# EAGLE schematic eib-256 (EAGLE 8.3.2)
DESIGNER: JON NEWMAN; DESIGN_NAME: EIB-256; LICENSE: CERN OHL v1.2; REVISION: 1.1
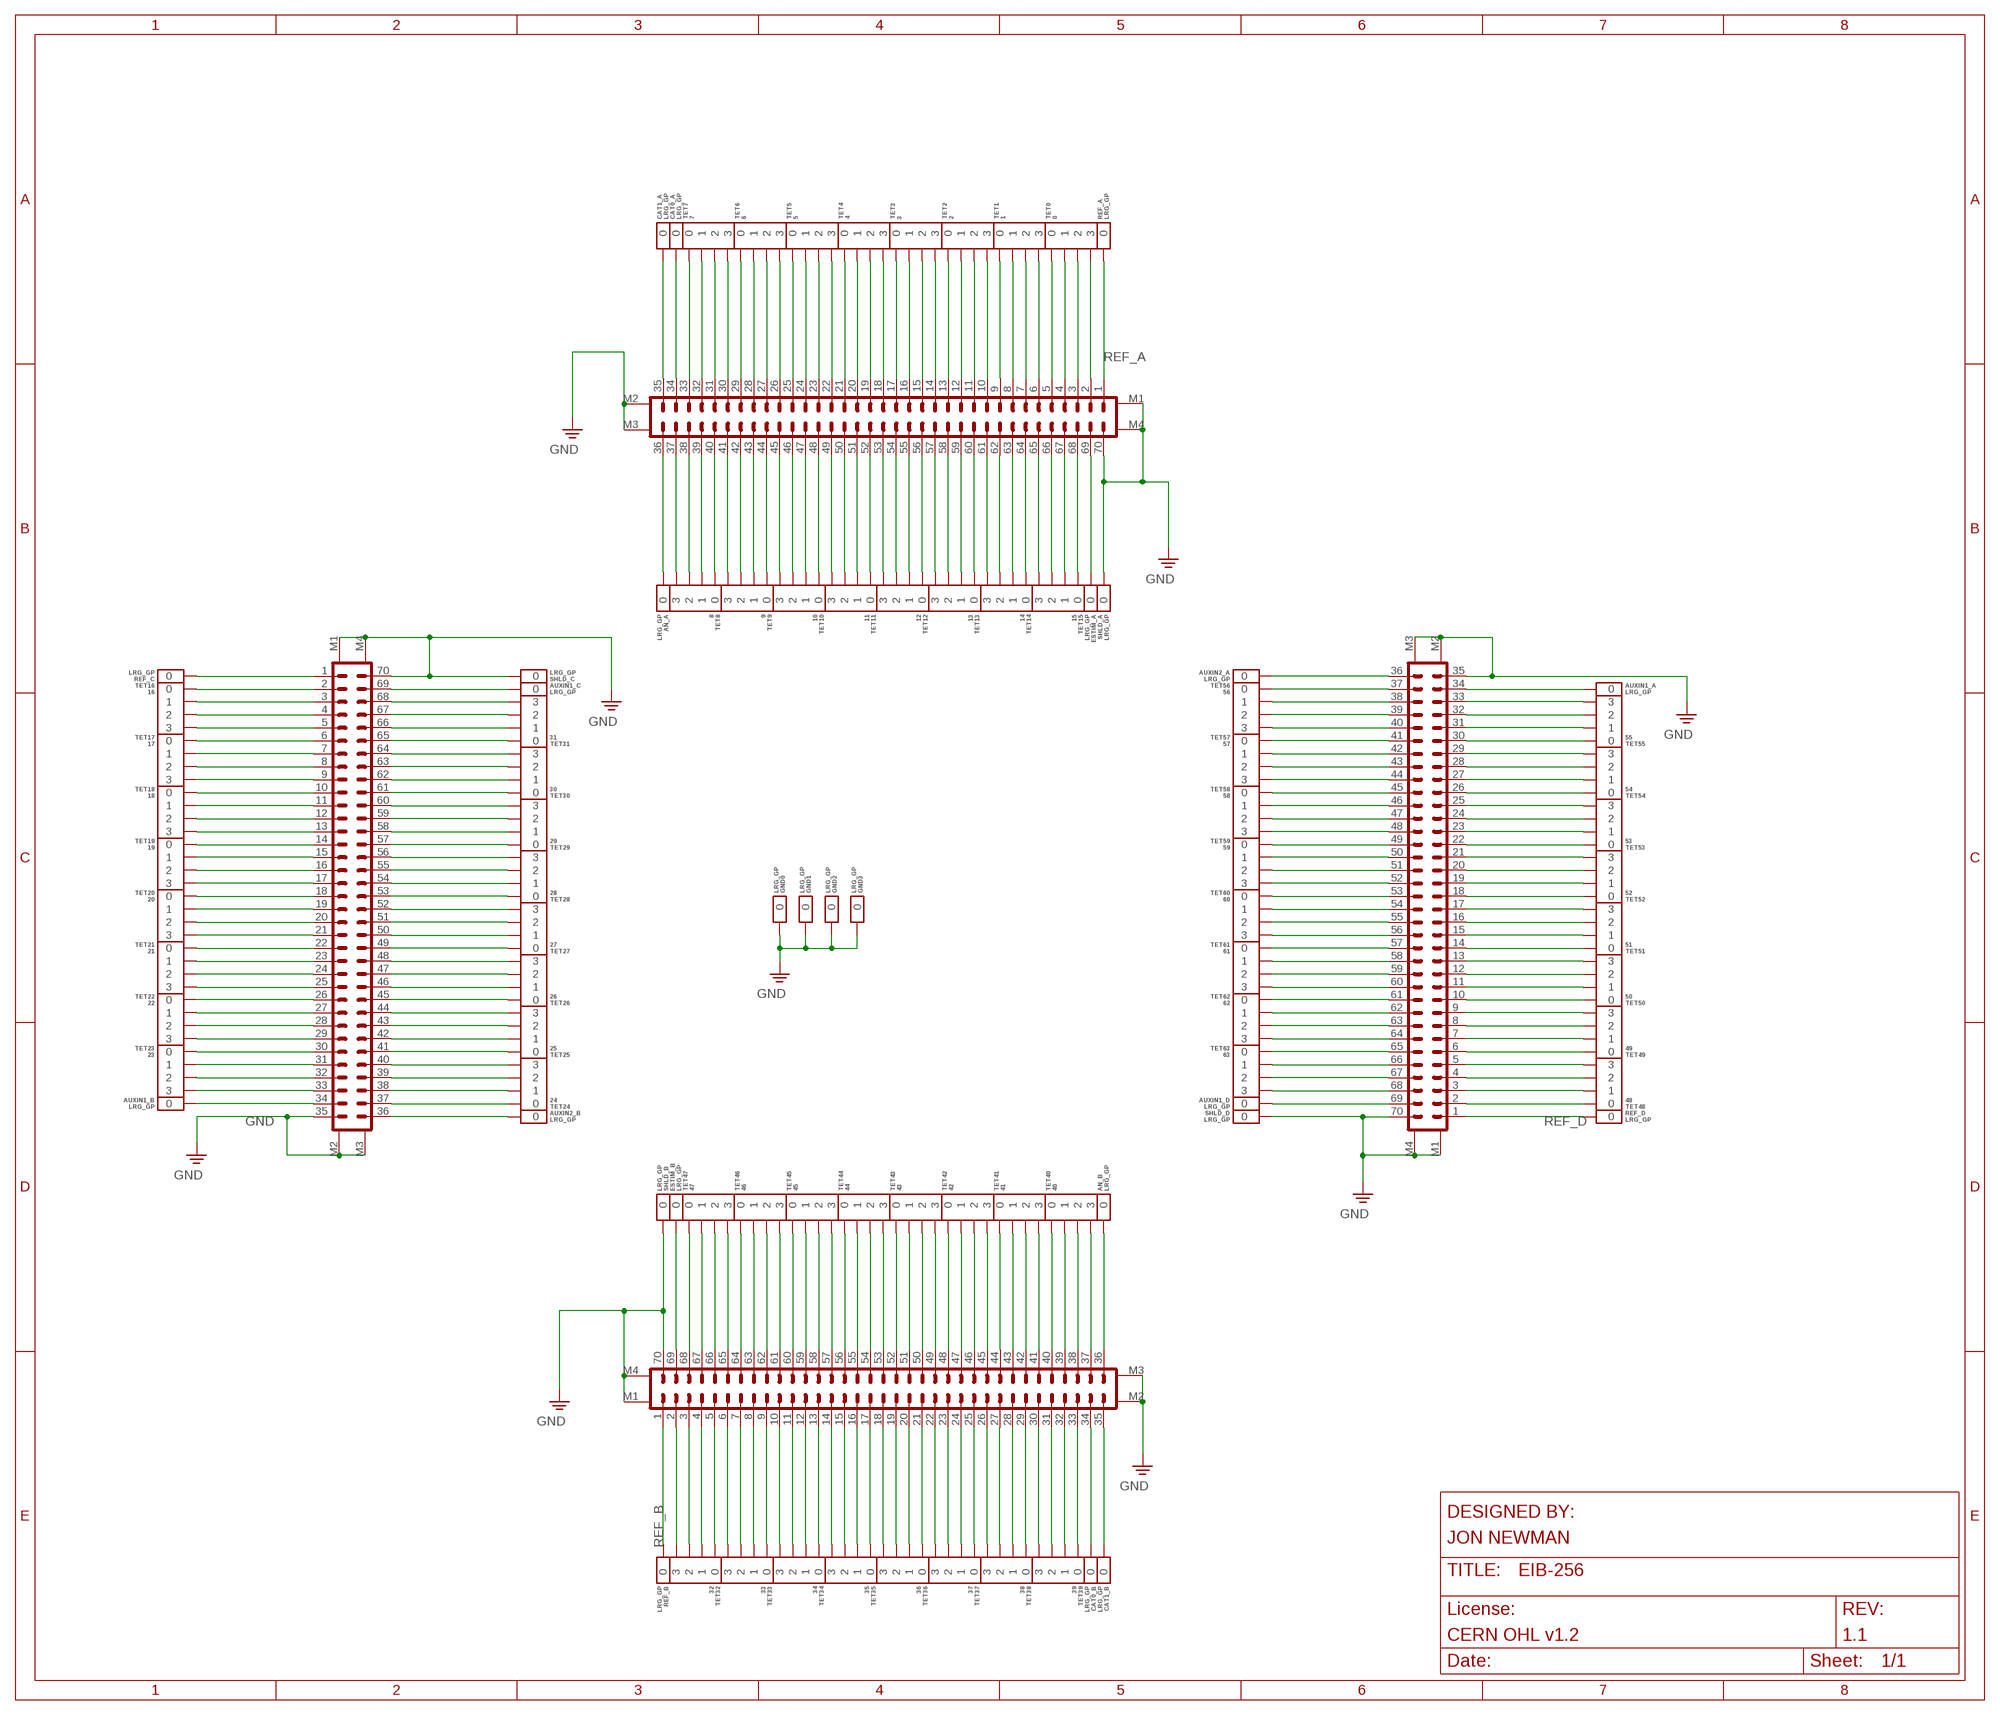
[diagram p0: schematic, sheet 1]

## Parts
A  DF40HEAD  PINHD-2X35+4_DF40-70HEAD  [DF40-70HEAD]
AN_A  LRG_GP  GOLDPIN_0.5ID_0.7OD  [GOLDPIN_0.5ID_0.7OD]
AN_B  LRG_GP  GOLDPIN_0.5ID_0.7OD  [GOLDPIN_0.5ID_0.7OD]
AUXIN1_A  LRG_GP  GOLDPIN_0.5ID_0.7OD  [GOLDPIN_0.5ID_0.7OD]
AUXIN1_B  LRG_GP  GOLDPIN_0.5ID_0.7OD  [GOLDPIN_0.5ID_0.7OD]
AUXIN1_C  LRG_GP  GOLDPIN_0.5ID_0.7OD  [GOLDPIN_0.5ID_0.7OD]
AUXIN1_D  LRG_GP  GOLDPIN_0.5ID_0.7OD  [GOLDPIN_0.5ID_0.7OD]
AUXIN2_A  LRG_GP  GOLDPIN_0.5ID_0.7OD  [GOLDPIN_0.5ID_0.7OD]
AUXIN2_B  LRG_GP  GOLDPIN_0.5ID_0.7OD  [GOLDPIN_0.5ID_0.7OD]
B  DF40HEAD  PINHD-2X35+4_DF40-70HEAD  [DF40-70HEAD]
C  DF40HEAD  PINHD-2X35+4_DF40-70HEAD  [DF40-70HEAD]
CAT0_A  LRG_GP  GOLDPIN_0.5ID_0.7OD  [GOLDPIN_0.5ID_0.7OD]
CAT0_B  LRG_GP  GOLDPIN_0.5ID_0.7OD  [GOLDPIN_0.5ID_0.7OD]
CAT1_A  LRG_GP  GOLDPIN_0.5ID_0.7OD  [GOLDPIN_0.5ID_0.7OD]
CAT1_B  LRG_GP  GOLDPIN_0.5ID_0.7OD  [GOLDPIN_0.5ID_0.7OD]
D  DF40HEAD  PINHD-2X35+4_DF40-70HEAD  [DF40-70HEAD]
ESTIM_A  LRG_GP  GOLDPIN_0.5ID_0.7OD  [GOLDPIN_0.5ID_0.7OD]
ESTIM_B  LRG_GP  GOLDPIN_0.5ID_0.7OD  [GOLDPIN_0.5ID_0.7OD]
GND0  LRG_GP  GOLDPIN_0.5ID_0.7OD  [GOLDPIN_0.5ID_0.7OD]
GND1  LRG_GP  GOLDPIN_0.5ID_0.7OD  [GOLDPIN_0.5ID_0.7OD]
GND2  LRG_GP  GOLDPIN_0.5ID_0.7OD  [GOLDPIN_0.5ID_0.7OD]
GND3  LRG_GP  GOLDPIN_0.5ID_0.7OD  [GOLDPIN_0.5ID_0.7OD]
REF_A  LRG_GP  GOLDPIN_0.5ID_0.7OD  [GOLDPIN_0.5ID_0.7OD]
REF_B  LRG_GP  GOLDPIN_0.5ID_0.7OD  [GOLDPIN_0.5ID_0.7OD]
REF_C  LRG_GP  GOLDPIN_0.5ID_0.7OD  [GOLDPIN_0.5ID_0.7OD]
REF_D  LRG_GP  GOLDPIN_0.5ID_0.7OD  [GOLDPIN_0.5ID_0.7OD]
SHLD_A  LRG_GP  GOLDPIN_0.5ID_0.7OD  [GOLDPIN_0.5ID_0.7OD]
SHLD_B  LRG_GP  GOLDPIN_0.5ID_0.7OD  [GOLDPIN_0.5ID_0.7OD]
SHLD_C  LRG_GP  GOLDPIN_0.5ID_0.7OD  [GOLDPIN_0.5ID_0.7OD]
SHLD_D  LRG_GP  GOLDPIN_0.5ID_0.7OD  [GOLDPIN_0.5ID_0.7OD]
TET0  0  TETRODE_0.3ID_LINEAR  [TETRODE_0.3ID_LINEAR]
TET1  1  TETRODE_0.3ID_LINEAR  [TETRODE_0.3ID_LINEAR]
TET2  2  TETRODE_0.3ID_LINEAR  [TETRODE_0.3ID_LINEAR]
TET3  3  TETRODE_0.3ID_LINEAR  [TETRODE_0.3ID_LINEAR]
TET4  4  TETRODE_0.3ID_LINEAR  [TETRODE_0.3ID_LINEAR]
TET5  5  TETRODE_0.3ID_LINEAR  [TETRODE_0.3ID_LINEAR]
TET6  6  TETRODE_0.3ID_LINEAR  [TETRODE_0.3ID_LINEAR]
TET7  7  TETRODE_0.3ID_LINEAR  [TETRODE_0.3ID_LINEAR]
TET8  8  TETRODE_0.3ID_LINEAR  [TETRODE_0.3ID_LINEAR]
TET9  9  TETRODE_0.3ID_LINEAR  [TETRODE_0.3ID_LINEAR]
TET10  10  TETRODE_0.3ID_LINEAR  [TETRODE_0.3ID_LINEAR]
TET11  11  TETRODE_0.3ID_LINEAR  [TETRODE_0.3ID_LINEAR]
TET12  12  TETRODE_0.3ID_LINEAR  [TETRODE_0.3ID_LINEAR]
TET13  13  TETRODE_0.3ID_LINEAR  [TETRODE_0.3ID_LINEAR]
TET14  14  TETRODE_0.3ID_LINEAR  [TETRODE_0.3ID_LINEAR]
TET15  15  TETRODE_0.3ID_LINEAR  [TETRODE_0.3ID_LINEAR]
TET16  16  TETRODE_0.3ID_LINEAR  [TETRODE_0.3ID_LINEAR]
TET17  17  TETRODE_0.3ID_LINEAR  [TETRODE_0.3ID_LINEAR]
TET18  18  TETRODE_0.3ID_LINEAR  [TETRODE_0.3ID_LINEAR]
TET19  19  TETRODE_0.3ID_LINEAR  [TETRODE_0.3ID_LINEAR]
TET20  20  TETRODE_0.3ID_LINEAR  [TETRODE_0.3ID_LINEAR]
TET21  21  TETRODE_0.3ID_LINEAR  [TETRODE_0.3ID_LINEAR]
TET22  22  TETRODE_0.3ID_LINEAR  [TETRODE_0.3ID_LINEAR]
TET23  23  TETRODE_0.3ID_LINEAR  [TETRODE_0.3ID_LINEAR]
TET24  24  TETRODE_0.3ID_LINEAR  [TETRODE_0.3ID_LINEAR]
TET25  25  TETRODE_0.3ID_LINEAR  [TETRODE_0.3ID_LINEAR]
TET26  26  TETRODE_0.3ID_LINEAR  [TETRODE_0.3ID_LINEAR]
TET27  27  TETRODE_0.3ID_LINEAR  [TETRODE_0.3ID_LINEAR]
TET28  28  TETRODE_0.3ID_LINEAR  [TETRODE_0.3ID_LINEAR]
TET29  29  TETRODE_0.3ID_LINEAR  [TETRODE_0.3ID_LINEAR]
TET30  30  TETRODE_0.3ID_LINEAR  [TETRODE_0.3ID_LINEAR]
TET31  31  TETRODE_0.3ID_LINEAR  [TETRODE_0.3ID_LINEAR]
TET32  32  TETRODE_0.3ID_LINEAR  [TETRODE_0.3ID_LINEAR]
TET33  33  TETRODE_0.3ID_LINEAR  [TETRODE_0.3ID_LINEAR]
TET34  34  TETRODE_0.3ID_LINEAR  [TETRODE_0.3ID_LINEAR]
TET35  35  TETRODE_0.3ID_LINEAR  [TETRODE_0.3ID_LINEAR]
TET36  36  TETRODE_0.3ID_LINEAR  [TETRODE_0.3ID_LINEAR]
TET37  37  TETRODE_0.3ID_LINEAR  [TETRODE_0.3ID_LINEAR]
TET38  38  TETRODE_0.3ID_LINEAR  [TETRODE_0.3ID_LINEAR]
TET39  39  TETRODE_0.3ID_LINEAR  [TETRODE_0.3ID_LINEAR]
TET40  40  TETRODE_0.3ID_LINEAR  [TETRODE_0.3ID_LINEAR]
TET41  41  TETRODE_0.3ID_LINEAR  [TETRODE_0.3ID_LINEAR]
TET42  42  TETRODE_0.3ID_LINEAR  [TETRODE_0.3ID_LINEAR]
TET43  43  TETRODE_0.3ID_LINEAR  [TETRODE_0.3ID_LINEAR]
TET44  44  TETRODE_0.3ID_LINEAR  [TETRODE_0.3ID_LINEAR]
TET45  45  TETRODE_0.3ID_LINEAR  [TETRODE_0.3ID_LINEAR]
TET46  46  TETRODE_0.3ID_LINEAR  [TETRODE_0.3ID_LINEAR]
TET47  47  TETRODE_0.3ID_LINEAR  [TETRODE_0.3ID_LINEAR]
TET48  48  TETRODE_0.3ID_LINEAR  [TETRODE_0.3ID_LINEAR]
TET49  49  TETRODE_0.3ID_LINEAR  [TETRODE_0.3ID_LINEAR]
TET50  50  TETRODE_0.3ID_LINEAR  [TETRODE_0.3ID_LINEAR]
TET51  51  TETRODE_0.3ID_LINEAR  [TETRODE_0.3ID_LINEAR]
TET52  52  TETRODE_0.3ID_LINEAR  [TETRODE_0.3ID_LINEAR]
TET53  53  TETRODE_0.3ID_LINEAR  [TETRODE_0.3ID_LINEAR]
TET54  54  TETRODE_0.3ID_LINEAR  [TETRODE_0.3ID_LINEAR]
TET55  55  TETRODE_0.3ID_LINEAR  [TETRODE_0.3ID_LINEAR]
TET56  56  TETRODE_0.3ID_LINEAR  [TETRODE_0.3ID_LINEAR]
TET57  57  TETRODE_0.3ID_LINEAR  [TETRODE_0.3ID_LINEAR]
TET58  58  TETRODE_0.3ID_LINEAR  [TETRODE_0.3ID_LINEAR]
TET59  59  TETRODE_0.3ID_LINEAR  [TETRODE_0.3ID_LINEAR]
TET60  60  TETRODE_0.3ID_LINEAR  [TETRODE_0.3ID_LINEAR]
TET61  61  TETRODE_0.3ID_LINEAR  [TETRODE_0.3ID_LINEAR]
TET62  62  TETRODE_0.3ID_LINEAR  [TETRODE_0.3ID_LINEAR]
TET63  63  TETRODE_0.3ID_LINEAR  [TETRODE_0.3ID_LINEAR]

## Nets
AN_A: A.36 AN_A.P$1
AN_B: AN_B.P$1 B.36
AUXIN1_A: AUXIN1_A.P$1 D.34
AUXIN1_B: AUXIN1_B.P$1 C.34
AUXIN1_C: AUXIN1_C.P$1 C.69
AUXIN1_D: AUXIN1_D.P$1 D.69
AUXIN2_A: AUXIN2_A.P$1 D.36
AUXIN2_B: AUXIN2_B.P$1 C.36
CAT0_A: A.34 CAT0_A.P$1
CAT0_B: B.34 CAT0_B.P$1
CAT1_A: A.35 CAT1_A.P$1
CAT1_B: B.35 CAT1_B.P$1
ESTIM_A: A.69 ESTIM_A.P$1
ESTIM_B: B.69 ESTIM_B.P$1
GND: A.70 A.M1 A.M2 A.M3 A.M4 B.70 B.M1 B.M2 B.M3 B.M4 C.35 C.70 C.M1 C.M2 C.M3 C.M4 D.35 D.70 D.M1 D.M2 D.M3 D.M4 GND0.P$1 GND1.P$1 GND2.P$1 GND3.P$1 SHLD_A.P$1 SHLD_B.P$1 SHLD_C.P$1 SHLD_D.P$1
N$1: D.2 TET48.0
N$2: D.3 TET48.1
N$3: D.4 TET48.2
N$4: D.5 TET48.3
N$5: D.6 TET49.0
N$6: D.7 TET49.1
N$7: D.8 TET49.2
N$8: D.9 TET49.3
N$9: D.10 TET50.0
N$10: D.11 TET50.1
N$11: D.12 TET50.2
N$12: D.13 TET50.3
N$13: D.14 TET51.0
N$14: D.15 TET51.1
N$15: D.16 TET51.2
N$16: D.17 TET51.3
N$17: D.18 TET52.0
N$18: D.19 TET52.1
N$19: D.20 TET52.2
N$20: D.21 TET52.3
N$21: D.22 TET53.0
N$22: D.23 TET53.1
N$23: D.24 TET53.2
N$24: D.25 TET53.3
N$25: D.26 TET54.0
N$26: D.27 TET54.1
N$27: D.28 TET54.2
N$28: D.29 TET54.3
N$29: D.30 TET55.0
N$30: D.31 TET55.1
N$31: D.32 TET55.2
N$32: D.42 TET57.1
N$33: D.43 TET57.2
N$34: D.44 TET57.3
N$35: D.45 TET58.0
N$36: D.46 TET58.1
N$37: D.47 TET58.2
N$38: D.48 TET58.3
N$39: D.49 TET59.0
N$40: D.50 TET59.1
N$41: D.51 TET59.2
N$42: D.52 TET59.3
N$43: D.53 TET60.0
N$44: D.54 TET60.1
N$45: D.55 TET60.2
N$46: D.56 TET60.3
N$47: D.57 TET61.0
N$48: D.58 TET61.1
N$49: D.59 TET61.2
N$50: D.60 TET61.3
N$51: D.61 TET62.0
N$52: D.62 TET62.1
N$53: D.63 TET62.2
N$54: D.64 TET62.3
N$55: D.65 TET63.0
N$56: D.66 TET63.1
N$57: D.67 TET63.2
N$58: D.68 TET63.3
N$59: D.41 TET57.0
N$60: D.40 TET56.3
N$61: D.39 TET56.2
N$62: D.38 TET56.1
N$63: D.33 TET55.3
N$64: D.37 TET56.0
N$65: C.3 TET16.1
N$66: C.2 TET16.0
N$67: C.32 TET23.2
N$68: C.33 TET23.3
N$69: C.28 TET22.2
N$70: C.29 TET22.3
N$71: C.24 TET21.2
N$72: C.25 TET21.3
N$73: C.20 TET20.2
N$74: C.21 TET20.3
N$75: C.16 TET19.2
N$76: C.17 TET19.3
N$77: C.12 TET18.2
N$78: C.13 TET18.3
N$79: C.8 TET17.2
N$80: C.9 TET17.3
N$81: C.66 TET31.1
N$82: C.65 TET31.0
N$83: C.62 TET30.1
N$84: C.64 TET30.3
N$85: C.58 TET29.1
N$86: C.57 TET29.0
N$87: C.54 TET28.1
N$88: C.53 TET28.0
N$89: C.49 TET27.0
N$90: C.50 TET27.1
N$91: C.46 TET26.1
N$92: C.45 TET26.0
N$93: C.42 TET25.1
N$94: C.41 TET25.0
N$95: C.38 TET24.1
N$96: C.37 TET24.0
N$193: B.33 TET39.0
N$194: B.32 TET39.1
N$195: B.31 TET39.2
N$196: B.30 TET39.3
N$197: B.29 TET38.0
N$198: B.28 TET38.1
N$199: A.33 TET7.0
N$200: A.32 TET7.1
N$201: A.31 TET7.2
N$202: A.30 TET7.3
N$203: A.29 TET6.0
N$204: A.28 TET6.1
N$205: A.27 TET6.2
N$206: A.26 TET6.3
N$207: A.25 TET5.0
N$208: A.24 TET5.1
N$209: A.23 TET5.2
N$210: A.22 TET5.3
N$211: A.21 TET4.0
N$212: A.20 TET4.1
N$213: A.19 TET4.2
N$214: A.18 TET4.3
N$215: A.17 TET3.0
N$216: A.16 TET3.1
N$217: A.15 TET3.2
N$218: A.14 TET3.3
N$219: A.13 TET2.0
N$220: A.12 TET2.1
N$221: A.11 TET2.2
N$222: A.10 TET2.3
N$223: A.9 TET1.0
N$224: A.8 TET1.1
N$225: A.7 TET1.2
N$226: A.6 TET1.3
N$227: A.5 TET0.0
N$228: A.4 TET0.1
N$229: A.3 TET0.2
N$230: A.2 TET0.3
N$231: A.38 TET8.2
N$232: A.39 TET8.1
N$233: A.40 TET8.0
N$234: A.41 TET9.3
N$235: A.42 TET9.2
N$236: A.43 TET9.1
N$237: A.44 TET9.0
N$238: A.45 TET10.3
N$239: A.46 TET10.2
N$240: A.47 TET10.1
N$241: A.48 TET10.0
N$242: A.49 TET11.3
N$243: A.50 TET11.2
N$244: A.51 TET11.1
N$245: A.52 TET11.0
N$246: A.53 TET12.3
N$247: A.54 TET12.2
N$248: A.55 TET12.1
N$249: A.56 TET12.0
N$250: A.57 TET13.3
N$251: A.58 TET13.2
N$252: A.59 TET13.1
N$253: A.60 TET13.0
N$254: A.61 TET14.3
N$255: A.62 TET14.2
N$256: A.63 TET14.1
N$257: A.64 TET14.0
N$258: A.65 TET15.3
N$259: A.66 TET15.2
N$260: A.67 TET15.1
N$261: A.68 TET15.0
N$262: B.27 TET38.2
N$263: B.26 TET38.3
N$264: B.25 TET37.0
N$265: B.24 TET37.1
N$266: B.23 TET37.2
N$267: B.22 TET37.3
N$268: B.21 TET36.0
N$269: B.20 TET36.1
N$270: B.19 TET36.2
N$271: B.18 TET36.3
N$272: B.17 TET35.0
N$273: B.16 TET35.1
N$274: B.15 TET35.2
N$275: B.14 TET35.3
N$276: B.13 TET34.0
N$277: B.12 TET34.1
N$278: B.11 TET34.2
N$279: B.10 TET34.3
N$280: B.9 TET33.0
N$281: B.8 TET33.1
N$282: B.7 TET33.2
N$283: B.6 TET33.3
N$284: B.5 TET32.0
N$285: B.4 TET32.1
N$286: B.3 TET32.2
N$287: B.38 TET40.2
N$288: B.39 TET40.1
N$289: B.40 TET40.0
N$290: B.41 TET41.3
N$291: B.42 TET41.2
N$292: B.43 TET41.1
N$293: B.44 TET41.0
N$294: B.45 TET42.3
N$295: B.46 TET42.2
N$296: B.47 TET42.1
N$297: B.48 TET42.0
N$298: B.49 TET43.3
N$299: B.50 TET43.2
N$300: B.51 TET43.1
N$301: B.52 TET43.0
N$302: B.53 TET44.3
N$303: B.54 TET44.2
N$304: B.55 TET44.1
N$305: B.56 TET44.0
N$306: B.57 TET45.3
N$307: B.58 TET45.2
N$308: B.59 TET45.1
N$309: B.60 TET45.0
N$310: B.61 TET46.3
N$311: B.62 TET46.2
N$312: B.63 TET46.1
N$313: B.64 TET46.0
N$314: B.65 TET47.3
N$315: B.66 TET47.2
N$316: B.67 TET47.1
N$317: B.68 TET47.0
N$318: B.2 TET32.3
N$319: B.37 TET40.3
N$322: C.4 TET16.2
N$323: C.5 TET16.3
N$324: C.6 TET17.0
N$326: C.7 TET17.1
N$328: C.10 TET18.0
N$330: C.11 TET18.1
N$332: C.14 TET19.0
N$334: C.15 TET19.1
N$336: C.18 TET20.0
N$338: C.19 TET20.1
N$340: C.22 TET21.0
N$341: C.23 TET21.1
N$345: C.27 TET22.1
N$347: C.26 TET22.0
N$348: C.30 TET23.0
N$350: C.31 TET23.1
N$352: C.43 TET25.2
N$354: C.48 TET26.3
N$356: C.47 TET26.2
N$358: C.52 TET27.3
N$360: C.51 TET27.2
N$362: C.56 TET28.3
N$364: C.55 TET28.2
N$366: C.60 TET29.3
N$368: C.59 TET29.2
N$370: C.61 TET30.0
N$372: C.63 TET30.2
N$374: C.68 TET31.3
N$376: C.67 TET31.2
N$379: C.44 TET25.3
N$382: C.39 TET24.2
N$383: C.40 TET24.3
N$1000: A.37 TET8.3
REF_A: A.1 REF_A.P$1
REF_B: B.1 REF_B.P$1
REF_C: C.1 REF_C.P$1
REF_D: D.1 REF_D.P$1

## Library data of the parts
A B C D = jonnew:PINHD-2X35+4
AN_A AN_B AUXIN1_A AUXIN1_B AUXIN1_C AUXIN1_D AUXIN2_A AUXIN2_B CAT0_A CAT0_B CAT1_A CAT1_B ESTIM_A ESTIM_B GND0 GND1-GND3 REF_A REF_B REF_C REF_D SHLD_A SHLD_B SHLD_C SHLD_D = jonnew:GOLDPIN
TET0 TET1-TET63 = jonnew:TETRODE

## Net classes
1 thick: width 0.102 mm